# Altium schematic sheet 4bitMux2_flipped.SchDoc
size A; SheetNumber: 2; SheetTotal: 2
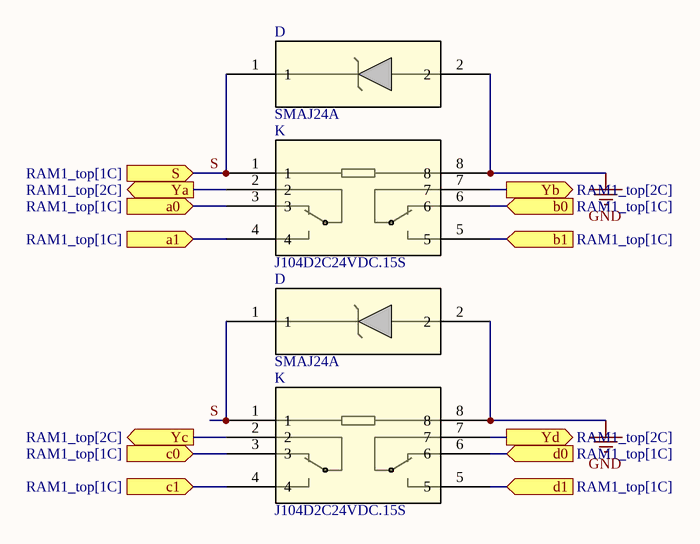
[diagram p0: 4bitMux2_flipped.SchDoc]

## Parts
(Parts that share a designator on the sheet are numbered #1, #2 ... from top to bottom, then left to right.)
D#1  SMAJ24A  [DI SMAJ24A]
D#2  SMAJ24A  [DI SMAJ24A]
K#1  J104D2C24VDC.15S  [Relay J104D2C24VDC.15S]
K#2  J104D2C24VDC.15S  [Relay J104D2C24VDC.15S]

## Ports
a0 (in, see RAM1_top[1C]), a1 (in, see RAM1_top[1C]), b0 (in, see RAM1_top[1C]), b1 (in, see RAM1_top[1C]), c0 (in, see RAM1_top[1C]), c1 (in, see RAM1_top[1C]), d0 (in, see RAM1_top[1C]), d1 (in, see RAM1_top[1C]), S (in, see RAM1_top[1C]), Ya (out, see RAM1_top[2C]), Yb (out, see RAM1_top[2C]), Yc (out, see RAM1_top[2C]), Yd (out, see RAM1_top[2C])

## Nets
GND: D#1.2 D#2.2 K#1.8 K#2.8
a0: K#1.3 ; port a0
a1: K#1.4 ; port a1
b0: K#1.6 ; port b0
b1: K#1.5 ; port b1
c0: K#2.3 ; port c0
c1: K#2.4 ; port c1
d0: K#2.6 ; port d0
d1: K#2.5 ; port d1
S: D#1.1 D#2.1 K#1.1 K#2.1 ; port S
Ya: K#1.2 ; port Ya
Yb: K#1.7 ; port Yb
Yc: K#2.2 ; port Yc
Yd: K#2.7 ; port Yd

## Library data of the parts
D#1 D#2 = DI SMAJ24A: SMAJ Series 400 W 24 V Uni-Directional Surface Mount TVS Diode - DO-214AC; Manufacturer: Littelfuse; Breakdown Voltage: 28.1V; Value: 650pF; Clamping Voltage: 38.9V; Direction: Unidirectional; Element Configuration: Single; Forward Voltage: 3.5V; Leakage Current: 1µA; Max Breakdown Voltage: 29.5V; Max Junction Temperature (Tj): 150°C; Max Output current: 10.3A; Max Power Dissipation: 3.3W; Min Breakdown Voltage: 26.7V; Number of Channels: 1; Operating Supply Voltage: 24V; Peak Pulse Power: 400W; Power Line Protection: No; Test Current: 1mA; Supplier: DigiKey; Supplier Part Number: SMAJ24ALFCT-ND; Manufacturer Part Number: SMAJ24A; RoHS: Compliant; Category: TVS Diodes; Stock: 97583; Pricing: 1=0.21, 10=0.113, 100=0.074, 500=0.072, 1000=0.071 (USD); Case/Package: SMA; China RoHS: Non-Compliant; Composition: Zener; Height: 2.29mm; Lead Free: Lead Free; Length: 4.5mm; Lifecycle Status: Production; Max Operating Temperature: 150°C; Max Reverse Leakage Current: 1µA; Max Surge Current: 10.3A; Min Operating Temperature: -65°C; Mounting Technology: Surface Mount; Number of Elements: 1; Pins: 2; Number of Terminals: 2; Number of Unidirectional Channels: 1; Packaging: Tape & Reel; Peak Pulse Current: 10.3A; Peak Reverse Current: 1µA; Polarity: Unidirectional; Power Dissipation: 400W; Power Rating: 400W; Radiation Hardening: No; REACH SVHC: No; Reverse Breakdown Voltage: 26.7V; Reverse Standoff Voltage: 24V; Reverse Voltage: 24V; Schedule B: 8541100080, 8541100080|8541100080|8541100080|8541100080|8541100080; Termination: SMD/SMT; Voltage Rating (DC): 24V; Width: 2.79mm; ComponentLink1URL: https://datasheet.octopart.com:443/SMAJ24A-Littelfuse-datasheet-150463581.pdf?src-supplier=Farnell; ComponentLink1Description: https://datasheet.octopart.com:443/SMAJ24A-Littelfuse-datasheet-150463581.pdf?src-supplier=Farnell; ComponentLink2URL: https://datasheet.octopart.com:443/SMAJ24A-Littelfuse-datasheet-63710798.pdf?src-supplier=element14+APAC; ComponentLink2Description: https://datasheet.octopart.com:443/SMAJ24A-Littelfuse-datasheet-63710798.pdf?src-supplier=element14+APAC; ComponentLink3URL: https://datasheet.octopart.com:443/SMAJ24A-Littelfuse-datasheet-11547152.pdf?src-supplier=element14+APAC; ComponentLink3Description: https://datasheet.octopart.com:443/SMAJ24A-Littelfuse-datasheet-11547152.pdf?src-supplier=element14+APAC; ComponentLink4URL: https://datasheet.octopart.com:443/SMAJ24A-Littelfuse-datasheet-5393952.pdf?src-supplier=element14+APAC; ComponentLink4Description: https://datasheet.octopart.com:443/SMAJ24A-Littelfuse-datasheet-5393952.pdf?src-supplier=element14+APAC; ComponentLink5URL: https://datasheet.octopart.com:443/SMAJ24A-Littelfuse-datasheet-511791.pdf?src-supplier=element14+APAC; ComponentLink5Description: https://datasheet.octopart.com:443/SMAJ24A-Littelfuse-datasheet-511791.pdf?src-supplier=element14+APAC; ComponentLink6URL: https://datasheet.octopart.com:443/SMAJ24A-Littelfuse-datasheet-164649624.pdf?src-supplier=JRH+Electronics; ComponentLink6Description: https://datasheet.octopart.com:443/SMAJ24A-Littelfuse-datasheet-164649624.pdf?src-supplier=JRH+Electronics; ComponentLink7URL: https://datasheet.octopart.com:443/SMAJ24A-Littelfuse-datasheet-38878911.pdf?src-supplier=RS+(Formerly+Allied+Electronics); ComponentLink7Description: https://datasheet.octopart.com:443/SMAJ24A-Littelfuse-datasheet-38878911.pdf?src-supplier=RS+(Formerly+Allied+Electronics); ComponentLink8URL: https://datasheet.octopart.com:443/SMAJ24A-Littelfuse-datasheet-17901671.pdf?src-supplier=Future+Electronics; ComponentLink8Description: https://datasheet.octopart.com:443/SMAJ24A-Littelfuse-datasheet-17901671.pdf?src-supplier=Future+Electronics; ComponentLink9URL: https://datasheet.octopart.com:443/SMAJ24A-Littelfuse-datasheet-1053.pdf?src-supplier=DigiKey; ComponentLink9Description: https://datasheet.octopart.com:443/SMAJ24A-Littelfuse-datasheet-1053.pdf?src-supplier=DigiKey
K#1 K#2 = Relay J104D2C24VDC.15S: Relay Ul Gen Purp DPDT 2C 24VDC; Manufacturer: CIT Relay & Switch; Coil Current: 6mA; Coil Power: 150mW; Coil Resistance: 3.84kΩ; Coil Voltage (DC): 18V; Contact Current Rating: 2A; Contact Resistance: 50mΩ; Contact Voltage Rating (AC): 250V; Electrical Life: 100kcycles; Insulation Resistance: 100MΩ; Max Voltage Rating (DC): 100V; Release Time: 4ms; Response Time: 6ms; Supplier: DigiKey; Supplier Part Number: 2449-J104D2C24VDC.15S-ND; Manufacturer Part Number: J104D2C24VDC.15S; Category: Signal Relays; Stock: 5620; Pricing: 1=1.26, 20=1.082, 40=1.045, 60=1.02383, 100=0.998, 260=0.95115, 500=0.92036, 1000=0.88878, 5000=0.8195 (USD); Contact Plating: Gold; Height: 11.42mm; Length: 20.37mm; Max Current Rating: 2A; Max Operating Temperature: 85°C; Min Operating Temperature: -40°C; Number of Terminals: 8; Throw Configuration: DPDT